# Altium schematic sheet AMU-S01-V00.SchDoc: AMU Master
size A3; DrawnBy: Thomas Benedetti; DocumentNumber: 1; SheetNumber: 1; SheetTotal: 12; Version: 00; Project: AMU 2020; PageSetup: Record=PageOptions|CenterHorizontal=True|CenterVertical=True|PrintScale=0.97|XCorrection=1.00|YCorrection=1.00|PrintKind=0|BorderSize=5000000|LeftOffset=0|BottomOffset=0|Orientation=2|PaperLength=1000|PaperWidth=1000|Scale=100|PaperSource=7|PrintQuality=-4|MediaType=1|DitherType=10|PaperKind=A4|PrintScaleMode=1
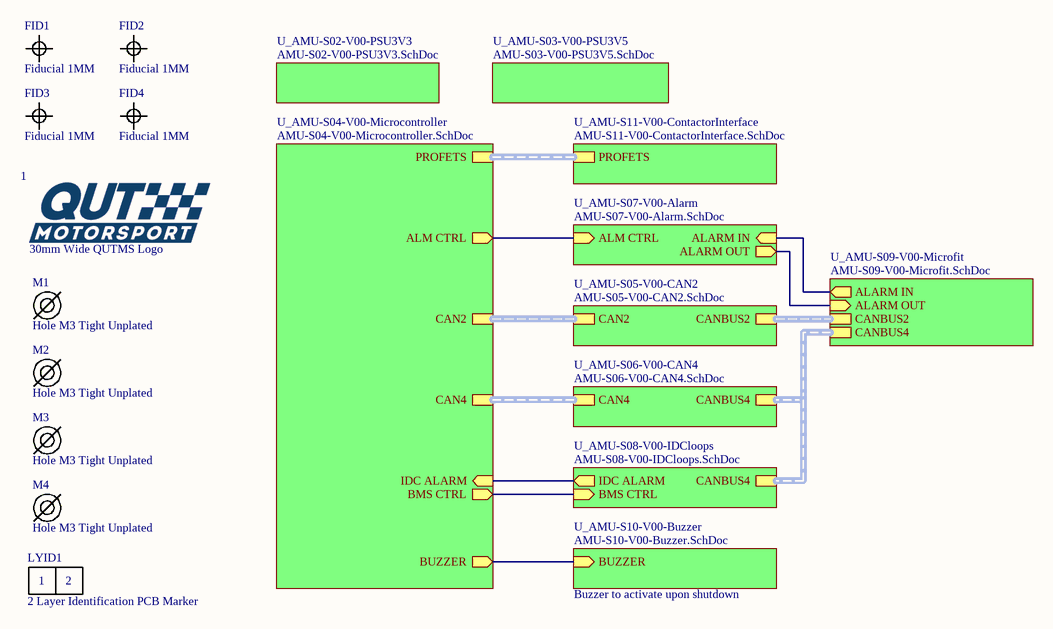
[diagram p0: AMU-S01-V00.SchDoc]

## Parts
1  30mm Wide QUTMS Logo  [QUTMS LOGO 30MM]
FID1  Fiducial 1MM  [FIDUCIAL 1MM]
FID2  Fiducial 1MM  [FIDUCIAL 1MM]
FID3  Fiducial 1MM  [FIDUCIAL 1MM]
FID4  Fiducial 1MM  [FIDUCIAL 1MM]
LYID1  2 Layer Identification PCB Marker  [LAYER IDENT 2]
M1  Hole M3 Tight Unplated  [M3.2 UNPLATED]
M2  Hole M3 Tight Unplated  [M3.2 UNPLATED]
M3  Hole M3 Tight Unplated  [M3.2 UNPLATED]
M4  Hole M3 Tight Unplated  [M3.2 UNPLATED]

## Sub-sheets
U_AMU-S02-V00-PSU3V3 = AMU-S02-V00-PSU3V3.SchDoc: no entries
U_AMU-S03-V00-PSU3V5 = AMU-S03-V00-PSU3V5.SchDoc: no entries
U_AMU-S04-V00-Microcontroller = AMU-S04-V00-Microcontroller.SchDoc: PROFETS, ALM CTRL (out), BMS CTRL (out), BUZZER (out), CAN2, CAN4, IDC ALARM (in)
U_AMU-S05-V00-CAN2 = AMU-S05-V00-CAN2.SchDoc: CANBUS2 (harness CANBUS2), CAN2 (harness CAN2)
U_AMU-S06-V00-CAN4 = AMU-S06-V00-CAN4.SchDoc: CANBUS4 (harness CANBUS4), CAN4 (harness CAN4)
U_AMU-S07-V00-Alarm = AMU-S07-V00-Alarm.SchDoc: ALARM IN (in), ALARM OUT (out), ALM CTRL (in)
U_AMU-S08-V00-IDCloops = AMU-S08-V00-IDCloops.SchDoc: BMS CTRL (in), CANBUS4 (harness CANBUS4), IDC ALARM (out)
U_AMU-S09-V00-Microfit = AMU-S09-V00-Microfit.SchDoc: CANBUS2 (harness CANBUS2), CANBUS4 (harness CANBUS4), ALARM OUT (in), ALARM IN (out)
U_AMU-S10-V00-Buzzer = AMU-S10-V00-Buzzer.SchDoc: BUZZER (in)
U_AMU-S11-V00-ContactorInterface = AMU-S11-V00-ContactorInterface.SchDoc: PROFETS (harness PROFETS)

## Nets
(unnamed): sheet U_AMU-S04-V00-Microcontroller/ALM CTRL, sheet U_AMU-S07-V00-Alarm/ALM CTRL
(unnamed): sheet U_AMU-S04-V00-Microcontroller/BMS CTRL, sheet U_AMU-S08-V00-IDCloops/BMS CTRL
(unnamed): sheet U_AMU-S04-V00-Microcontroller/BUZZER, sheet U_AMU-S10-V00-Buzzer/BUZZER
(unnamed): sheet U_AMU-S04-V00-Microcontroller/IDC ALARM, sheet U_AMU-S08-V00-IDCloops/IDC ALARM
(unnamed): sheet U_AMU-S07-V00-Alarm/ALARM IN, sheet U_AMU-S09-V00-Microfit/ALARM IN
(unnamed): sheet U_AMU-S07-V00-Alarm/ALARM OUT, sheet U_AMU-S09-V00-Microfit/ALARM OUT

## Buses and harness runs
harness sheet U_AMU-S04-V00-Microcontroller/CAN2 = sheet U_AMU-S05-V00-CAN2/CAN2
harness sheet U_AMU-S04-V00-Microcontroller/CAN4 = sheet U_AMU-S06-V00-CAN4/CAN4
harness sheet U_AMU-S04-V00-Microcontroller/PROFETS = sheet U_AMU-S11-V00-ContactorInterface/PROFETS
harness sheet U_AMU-S05-V00-CAN2/CANBUS2 = sheet U_AMU-S09-V00-Microfit/CANBUS2
harness sheet U_AMU-S06-V00-CAN4/CANBUS4 = sheet U_AMU-S08-V00-IDCloops/CANBUS4 = sheet U_AMU-S09-V00-Microfit/CANBUS4

## Notes on the sheet
- Buzzer to activate upon shutdown
- Revision History:
- Sheet Title:
- Rev
- Date
- Description
- Project:
- Size:
- Drawn By:
- A3
- Number:
- Revision:
- Sheet
- Version:
- of
- QUT Motorsport
- O-120, Gardens Point
- 2 George Street
- Brisbane, QLD 4000
- Australia
- Print Date:
- Print Time:
- File Name:
- (in symbol Layer Identification 2) 1; 2

## Library data of the parts
1 = QUTMS Logo 30mm
LYID1 = Layer Identification 2
M1-M4 = Hole M3 Tight Unplated: M3.2 Hole, No Plating